# EAGLE design arpie_synch_module (EAGLE 6.6.0)
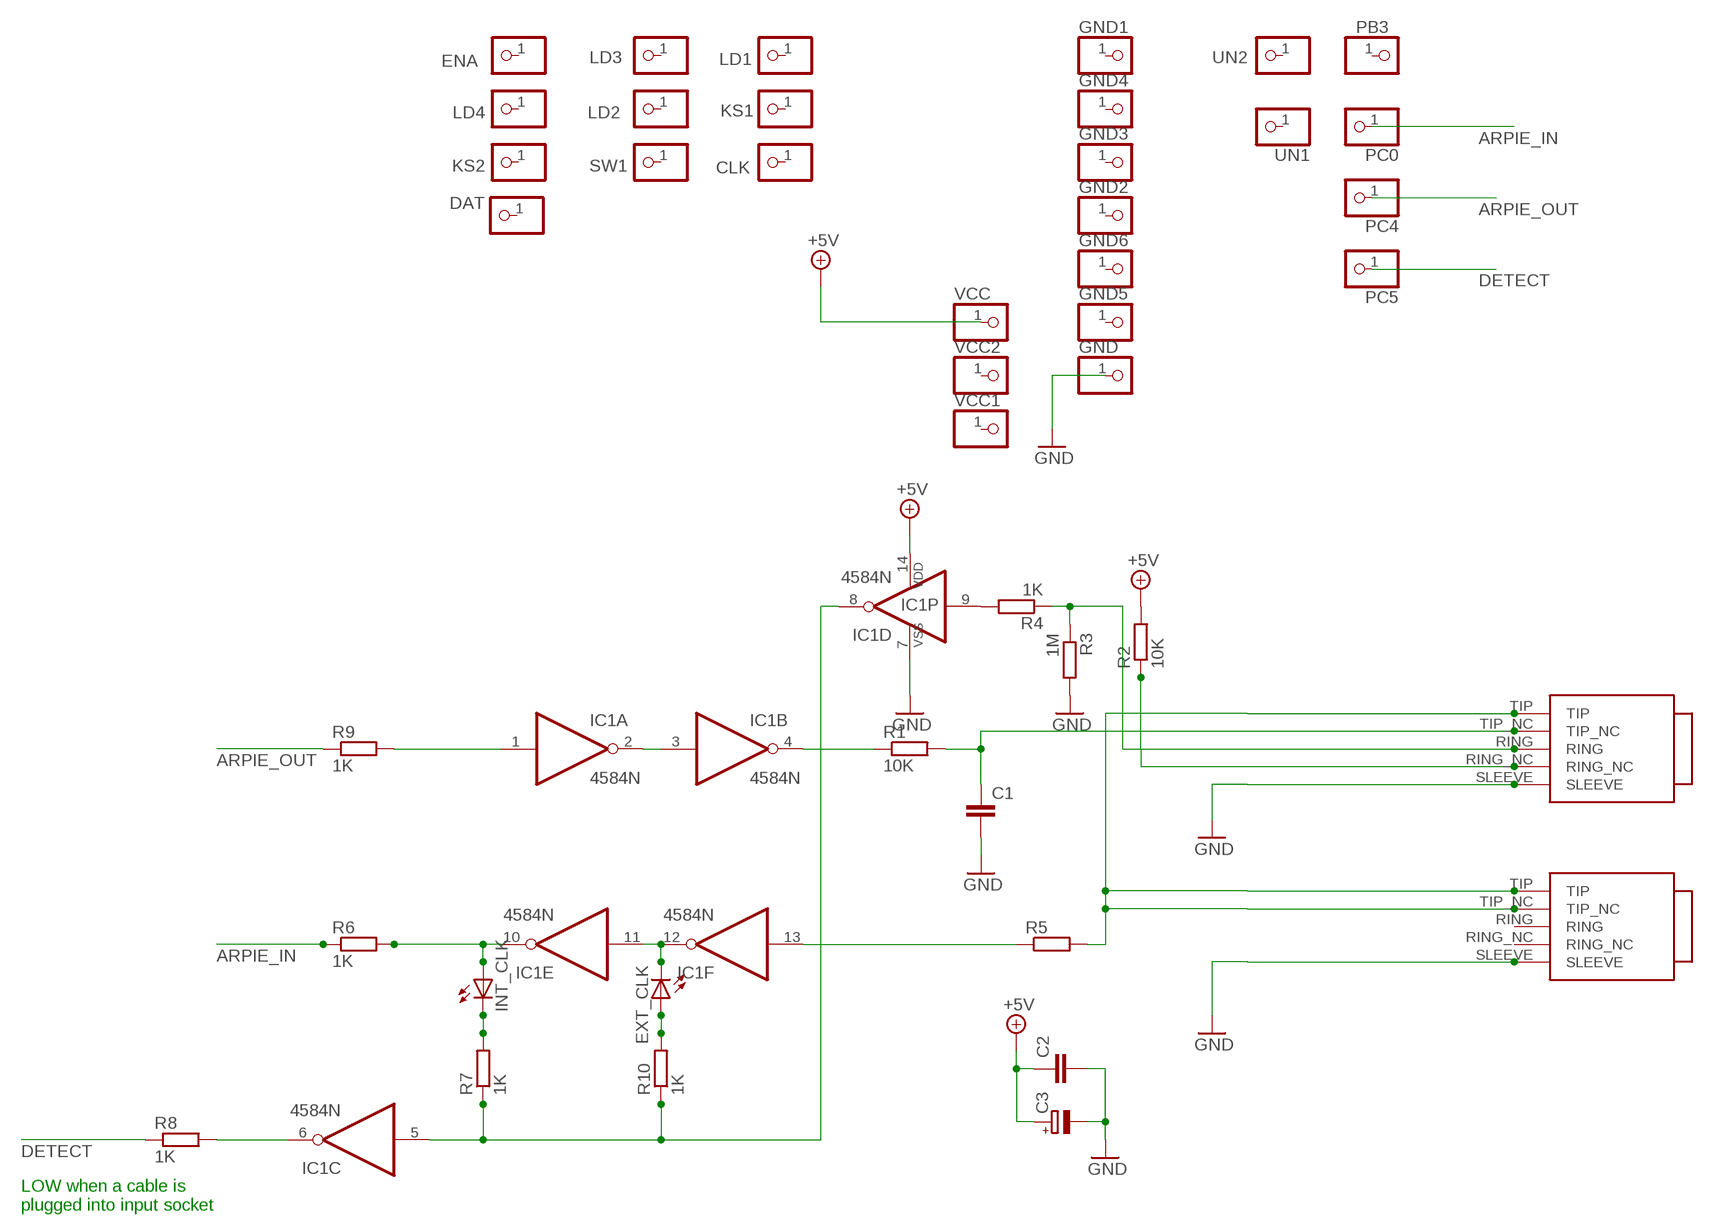
[diagram p0: schematic, sheet 1]

## Parts
C1  C-EU025-030X050  [C025-030X050]
C2  C-EU025-030X050  [C025-030X050]
C3  CPOL-EUE2-5  [E2-5]
CLK  PINHD-1X1  [1X01]
DAT  PINHD-1X1  [1X01]
ENA  PINHD-1X1  [1X01]
EXT_CLK  LED3MM  [LED3MM]
GND  PINHD-1X1  [1X01]
GND1  PINHD-1X1  [1X01]
GND2  PINHD-1X1  [1X01]
GND3  PINHD-1X1  [1X01]
GND4  PINHD-1X1  [1X01]
GND5  PINHD-1X1  [1X01]
GND6  PINHD-1X1  [1X01]
IC1  4584N  [DIL14]
INT_CLK  LED3MM  [LED3MM]
KS1  PINHD-1X1  [1X01]
KS2  PINHD-1X1  [1X01]
LD1  PINHD-1X1  [1X01]
LD2  PINHD-1X1  [1X01]
LD3  PINHD-1X1  [1X01]
LD4  PINHD-1X1  [1X01]
PB3  PINHD-1X1  [1X01]
PC0  PINHD-1X1  [1X01]
PC4  PINHD-1X1  [1X01]
PC5  PINHD-1X1  [1X01]
R1  10K  R-EU_0207/7  [0207/7]
R2  10K  R-EU_0207/7  [0207/7]
R3  1M  R-EU_0207/7  [0207/7]
R4  1K  R-EU_0207/7  [0207/7]
R5  R-EU_0207/7  [0207/7]
R6  1K  R-EU_0207/7  [0207/7]
R7  1K  R-EU_0207/7  [0207/7]
R8  1K  R-EU_0207/7  [0207/7]
R9  1K  R-EU_0207/7  [0207/7]
R10  1K  R-EU_0207/7  [0207/7]
SW1  PINHD-1X1  [1X01]
U$1  TRUCONNECTJACK  [TRUCONNECTJACK]
U$2  TRUCONNECTJACK  [TRUCONNECTJACK]
UN1  PINHD-1X1  [1X01]
UN2  PINHD-1X1  [1X01]
VCC  PINHD-1X1  [1X01]
VCC1  PINHD-1X1  [1X01]
VCC2  PINHD-1X1  [1X01]

## Nets
+5V: C2.1 C3.+ IC1.14(P:VDD) R2.2 VCC.1
ARPIE_IN: PC0.1 R6.1
ARPIE_OUT: PC4.1 R9.1
DETECT: PC5.1 R8.1
GND: C1.2 C2.2 C3.- GND.1 IC1.7(P:VSS) R3.2 U$1.SLEEVE U$2.SLEEVE
N$2: IC1.5(C:I) IC1.8(D:O) R7.1 R10.1
N$3: R5.2 U$1.TIP U$2.TIP U$2.TIP_NC
N$4: C1.1 R1.2 U$1.TIP_NC
N$5: IC1.4(B:O) R1.1
N$6: IC1.2(A:O) IC1.3(B:I)
N$8: IC1.1(A:I) R9.2
N$9: R2.1 U$1.RING_NC
N$10: INT_CLK.K(C) R7.2
N$11: R3.1 R4.1 U$1.RING
N$12: IC1.9(D:I) R4.2
N$13: IC1.6(C:O) R8.2
N$14: EXT_CLK.K(C) IC1.11(E:I) IC1.12(F:O)
N$15: IC1.13(F:I) R5.1
N$16: IC1.10(E:O) INT_CLK.A R6.2
N$17: EXT_CLK.A R10.2
Unconnected: CLK.1 DAT.1 ENA.1 GND1.1 GND2.1 GND3.1 GND4.1 GND5.1 GND6.1 KS1.1 KS2.1 LD1.1 LD2.1 LD3.1 LD4.1 PB3.1 SW1.1 U$2.RING U$2.RING_NC UN1.1 UN2.1 VCC1.1 VCC2.1

## Notes on the sheet
- LOW when a cable is 
  plugged into input socket

## Library data of the parts
C1 C2 = rcl:C-EU: CAPACITOR, European symbol
C3 = rcl:CPOL-EU: POLARIZED CAPACITOR, European symbol
CLK DAT ENA GND GND1-GND6 KS1 KS2 LD1-LD4 PB3 PC0 PC4 PC5 SW1 UN1 UN2 VCC VCC1 VCC2 = adafruit:PINHD-1X1: Pin header 1x1 for 0.1" spacing With round pins
EXT_CLK INT_CLK = adafruit:LED: LED OSRAM: - CHIPLED LG R971, LG N971, LY N971, LG Q971, LY Q971, LO R971, LY R971 LH N974, LH R974 LS Q976, LO Q976, LY Q976 LO Q996 - Hyper CHIPLED LW Q18S LB Q993, LB Q99A, LB R99A - SideLED LS A670, LO A670, LY A670, LG A670, LP A670 LB A673, LV A673, LT A673, LW A673 LH A674 LY A675 LS A676, LA A676, LO A676, LY A676, LW A676 LS A679, LY A679, LG A679 - Hyper Micro SIDELED® LS Y876, LA Y876, LO Y876, LY Y876 LT Y87S - SmartLED LW L88C, LW L88S LB L89C, LB L89S, LG L890 LS L89K, LO L89K, LY L89K LS L896, LA L896, LO L896, LY L896 - TOPLED LS T670, LO T670, LY T670, LG T670, LP T670 LSG T670, LSP T670, LSY T670, LOP T670, LYG T670 LG T671, LOG T671, LSG T671 LB T673, LV T673, LT T673, LW T673 LH T674 LS T676, LA T676, LO T676, LY T676, LB T676, LH T676, LSB T676, LW T676 LB T67C, LV T67C, LT T67C, LS T67K, LO T67K, LY T67K, LW E67C LS E67B, LA E67B, LO E67B, LY E67B, LB E67C, LV E67C, LT E67C LW T67C LS T679, LY T679, LG T679 LS T770, LO T770, LY T770, LG T770, LP T770 LB T773, LV T773, LT T773, LW T773 LH T774 LS E675, LA E675, LY E675, LS T675 LS T776, LA T776, LO T776, LY T776, LB T776 LHGB T686 LT T68C, LB T68C - Hyper Mini TOPLED® LB M676 - Mini TOPLED Santana® LG M470 LS M47K, LO M47K, LY M47K Source: http://www.osram.convergy.de/
IC1 = 45xx:4584: Hex SCHMITT TRIGGER (74C14)
R1-R10 = rcl:R-EU_: RESISTOR, European symbol
U$1 U$2 = jason_eagle6:TRUCONNECTJACK

## Board
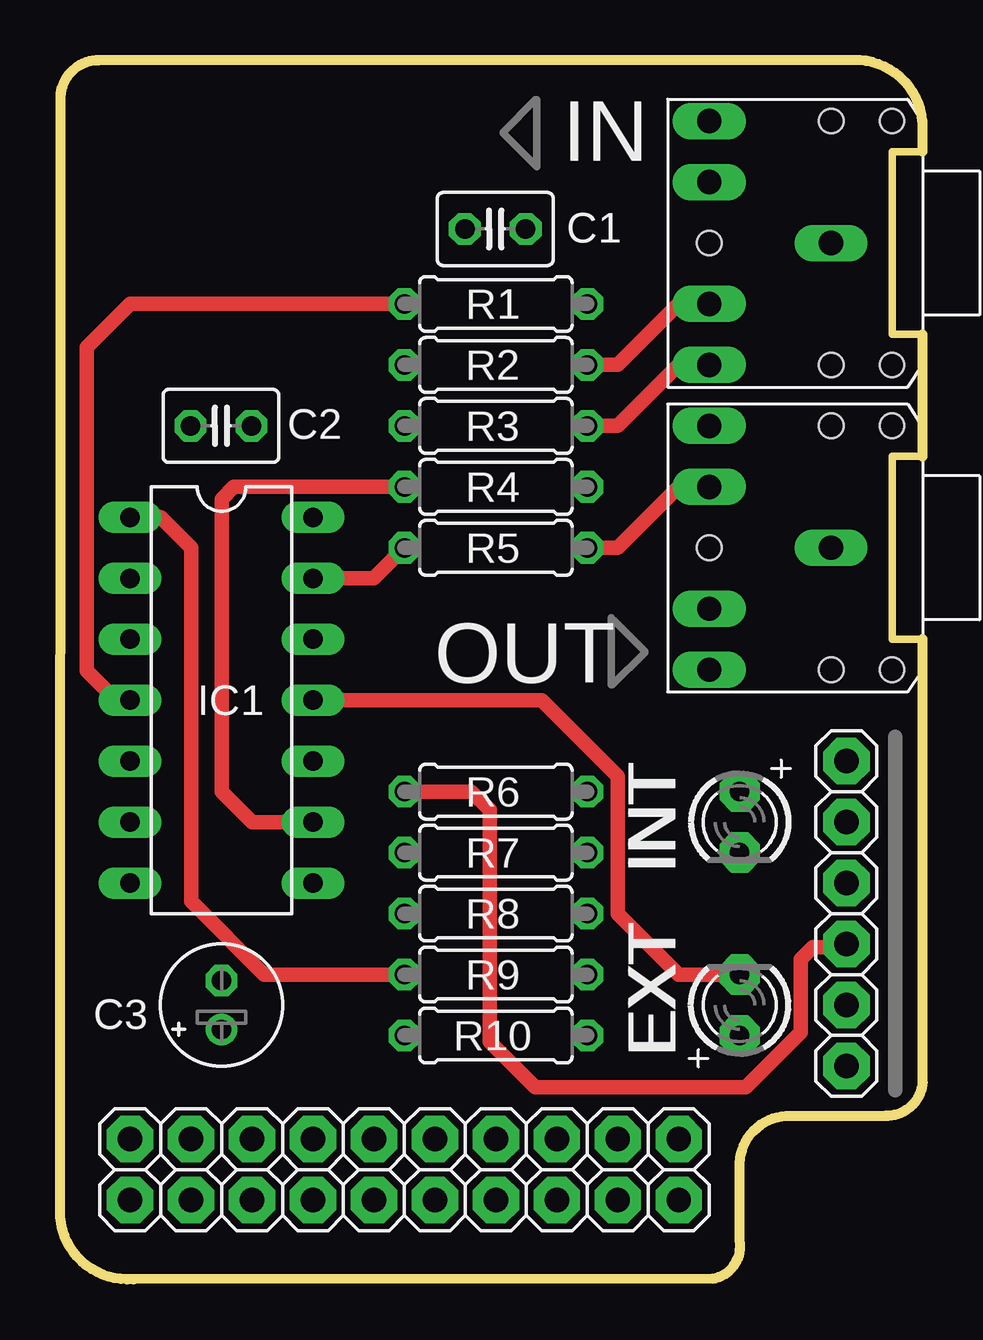
[diagram p1: board, top side]
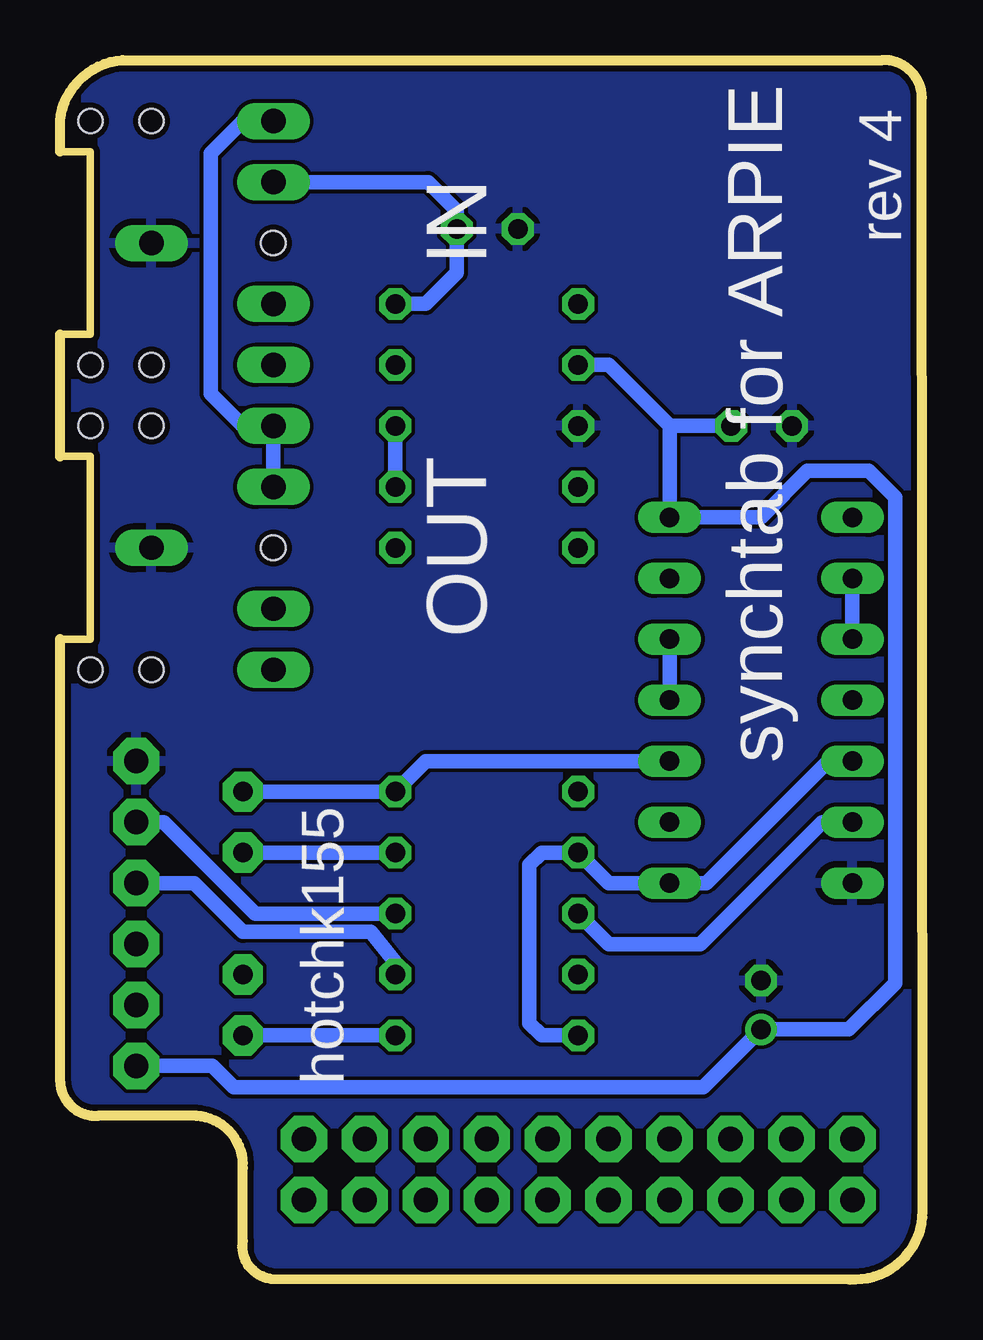
[diagram p2: board, bottom side, seen from below]

Size 35.94 x 50.82 mm. Coordinates in mm from the lower left corner, seen from the top.
Outline: 2.79,0.02 27.2,0.04 arc90 28.32,1.62 28.32,4.67 arc-90 30.25,6.82 34.37,6.82 arc90 35.94,8.27 35.94,12.59
Outline: 3.07,0 2.8,0.02 arc-90 0,2.86 0.02,49.27 arc-90 1.66,50.82
Outline: 35.94,48.26 arc81 33.33,50.82 1.65,50.82
Outline: 35.94,12.72 35.94,26.69 34.67,26.69 34.67,34.31 35.94,34.31 35.94,39.39 34.67,39.39 34.67,47.01 35.94,47.01 35.94,48.28
Copper layers (1*16): Top 0.035mm / dielectric 1.5mm / Bottom 0.035mm
Design rules "ITEADstudio_DRC": minimum track width 6mil, minimum drill 12mil, track to track 6mil, track to pad 6mil, pad to pad 6mil, via to via 6mil, smd to smd 0mil, copper to edge 10mil, drill to drill 10mil, minimum pad ring 10mil, minimum via ring 6mil, stop-mask expansion 2mil, vias tented up to drill 100mil, thermal gap 10mil

### Footprints (pad centres in the part's own frame; a part is rotated, then mirrored left to right if it is on the bottom)
C025-030X050 = drill 0.813 octagon: 1 -1.27,0; 2 1.27,0
E2-5 = drill 0.813 pad 1.27: + -1.016,0 | drill 0.813 pad 1.27 octagon: - 1.016,0
1X01 = drill 1.016 pad 1.93 octagon: 1 0,0
LED3MM = drill 0.813 pad 1.676 octagon: A -1.27,0; K 1.27,0
DIL14 = drill 0.813 long: 1 -7.62,-3.81; 2 -5.08,-3.81; 3 -2.54,-3.81; 4 0,-3.81; 5 2.54,-3.81; 6 5.08,-3.81; 7 7.62,-3.81; 8 7.62,3.81; 9 5.08,3.81; 10 2.54,3.81; 11 0,3.81; 12 -2.54,3.81; 13 -5.08,3.81; 14 -7.62,3.81
0207/7 = drill 0.813 octagon: 1 -3.81,0; 2 3.81,0
TRUCONNECTJACK = drill 1.016 long: RING -1.27,-5.08; RING_NC -1.27,-2.54; SLEEVE 3.81,0; TIP -1.27,5.08; TIP_NC -1.27,2.54 | hole 1.016: 3.81,5.08; 6.35,5.08; 3.81,-5.08; 6.35,-5.08; -1.27,0

### Placement (x,y rotation side)
C1  18.14,43.78 180 top
C2  6.71,35.58 180 top
C3  6.73,11.45 90 top
CLK  2.92,5.86 0 top
DAT  5.46,5.86 0 top
ENA  20.7,5.86 90 top
EXT_CLK  28.32,11.45 90 top
GND  32.77,21.61 0 top
GND1  8,3.32 0 top
GND2  10.54,3.32 0 top
GND3  13.08,3.32 0 top
GND4  15.62,3.32 0 top
GND5  18.16,3.32 0 top
GND6  20.7,3.32 0 top
IC1  6.73,24.15 270 top
INT_CLK  28.32,19.07 270 top
KS1  8,5.86 90 top
KS2  25.78,5.86 90 top
LD1  10.54,5.86 90 top
LD2  13.08,5.86 90 top
LD3  15.62,5.86 90 top
LD4  18.16,5.86 90 top
PB3  32.77,11.45 0 top
PC0  32.77,13.99 0 top
PC4  32.77,16.53 0 top
PC5  32.77,19.07 0 top
R1  18.16,40.66 0 top
R2  18.16,38.12 180 top
R3  18.16,35.58 180 top
R4  18.16,33.04 180 top
R5  18.16,30.5 0 top
R6  18.16,20.34 0 top
R7  18.16,17.8 0 top
R8  18.16,15.26 180 top
R9  18.16,12.72 180 top
R10  18.16,10.18 0 top
SW1  23.24,5.86 90 top
U$1  28.32,43.2 0 top
U$2  28.32,30.5 0 top
UN1  23.24,3.32 0 top
UN2  25.78,3.32 90 top
VCC  32.77,8.91 0 top
VCC1  2.92,3.32 0 top
VCC2  5.46,3.32 0 top

### Tracks (layer width: path | path; a pad name or v marks a point on that pad's centre or on a via)
+5V
  Bottom 0.61: 10.54,35.58 IC1.14 6.73,31.77 4.8,33.7 2.23,33.7 1.14,32.61 1.14,12.36 3.07,10.43 C3.+ 9.14,8.02 28.7,8.02 29.59,8.91 VCC.1 | 10.54,35.58 13.08,38.12 R2.2 | C2.1 10.54,35.58
ARPIE_IN
  Top 0.61: R6.1 17.15,20.34 17.91,19.58 17.91,9.92 19.81,8.02 28.57,8.02 30.86,10.3 30.86,13.35 31.37,13.86 32.64,13.86 PC0.1
ARPIE_OUT
  Bottom 0.61: R9.1 21.97,13.23 22.99,14.5 28.32,14.5 30.35,16.53 PC4.1
DETECT
  Bottom 0.61: R8.1 27.81,15.26 31.62,19.07 PC5.1
GND
  pour Bottom: -2.16,50.82 -2.16,-2.52 38.48,-2.52 38.48,50.82
N$2
  Bottom 0.61: IC1.5 3.94,21.61 9.02,16.53 IC1.8 13.08,16.53 R7.1 15.87,17.8 16.38,17.29 16.38,10.69 15.87,10.18 R10.1
N$3
  Top 0.61: R5.2 23.24,30.5 25.78,33.04 U$2.TIP_NC
  Bottom 0.61: U$2.TIP_NC U$2.TIP 28.32,35.58 29.67,36.92 29.67,46.93 28.32,48.28 U$1.TIP
N$4
  Bottom 0.61: R1.2 20.7,40.66 19.41,41.95 C1.1 19.41,44.54 20.6,45.74 U$1.TIP_NC
N$5
  Top 0.61: IC1.4 2.34,24.15 1.12,25.37 1.12,38.85 2.92,40.66 R1.1
N$6
  Bottom 0.61: IC1.2 IC1.3
N$8
  Top 0.61: IC1.1 4.19,31.77 5.46,30.5 5.46,15.77 8.51,12.72 R9.2
N$9
  Top 0.61: R2.1 23.24,38.12 25.78,40.66 U$1.RING_NC
N$10
  Bottom 0.61: R7.2 INT_CLK.K
N$11
  Top 0.61: R3.1 23.24,35.58 25.78,38.12 U$1.RING
  Bottom 0.61: R4.1 R3.1
N$12
  Top 0.61: IC1.9 8,19.07 6.73,20.34 6.73,32.53 7.24,33.04 R4.2
N$13
  Bottom 0.61: IC1.6 4.19,19.07 9.27,13.99 13.08,13.99 R8.2
N$14
  Top 0.61: IC1.11 20.07,24.15 23.24,20.97 23.24,15.26 25.78,12.72 EXT_CLK.K
  Bottom 0.61: IC1.11 IC1.12
N$15
  Top 0.61: IC1.13 13.08,29.23 R5.1
N$16
  Bottom 0.61: INT_CLK.A R6.2 20.7,21.61 IC1.10
N$17
  Bottom 0.61: R10.2 EXT_CLK.A

### Text on the board
tPlace: IN | OUT | INT | INT | EXT | EXT
bPlace: synchtab for ARPIE | rev 4 | IN | OUT | hotchk155